# EAGLE schematic BeVimExpansionBoard2 (EAGLE 7.3.0)
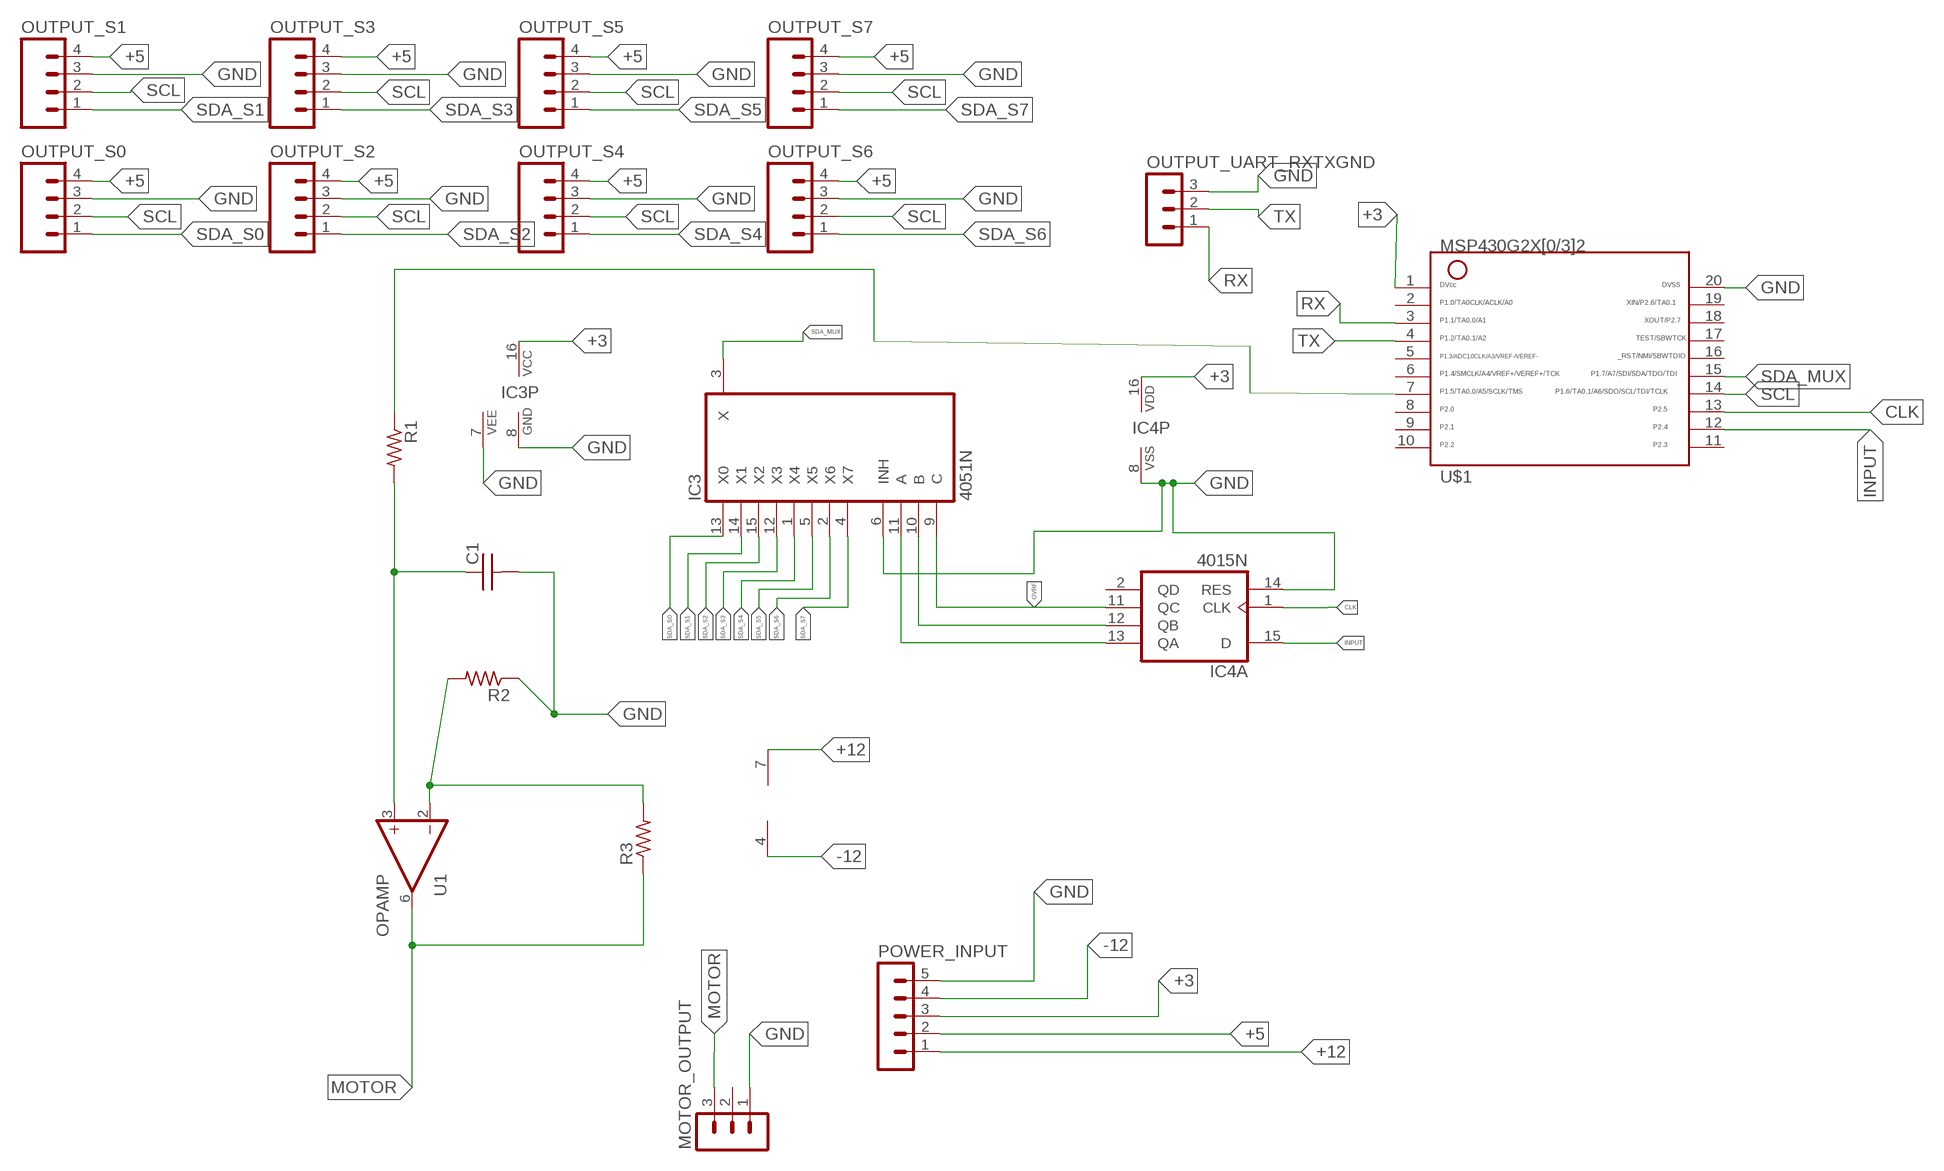
[diagram p0: schematic, sheet 1]

## Parts
C1  CAPACITOR  [BOX-2.5MM-7.2MM]
IC3  4051N  [DIL16]
IC4  4015N  [DIL16]
MOTOR_OUTPUT  MA03-1  [MA03-1]
OUTPUT_S0  M04LOCK  [1X04_LOCK]
OUTPUT_S1  M04LOCK  [1X04_LOCK]
OUTPUT_S2  M04LOCK  [1X04_LOCK]
OUTPUT_S3  M04LOCK  [1X04_LOCK]
OUTPUT_S4  M04LOCK  [1X04_LOCK]
OUTPUT_S5  M04LOCK  [1X04_LOCK]
OUTPUT_S6  M04LOCK  [1X04_LOCK]
OUTPUT_S7  M04LOCK  [1X04_LOCK]
OUTPUT_UART_RXTXGND  MA03-1  [MA03-1]
POWER_INPUT  MA05-1  [MA05-1]
R1  RESISTOR  [0.25W-0.3IN]
R2  RESISTOR  [0.25W-0.3IN]
R3  RESISTOR  [0.25W-0.3IN]
U1  OPAMP  [DIP8]
U$1  G2X[0/3]2---N20  [N20]

## Nets
+3: IC3.16(VCC) IC4.16(P:VDD) POWER_INPUT.3 U$1.1
+5: OUTPUT_S0.4 OUTPUT_S1.4 OUTPUT_S2.4 OUTPUT_S3.4 OUTPUT_S4.4 OUTPUT_S5.4 OUTPUT_S6.4 OUTPUT_S7.4 POWER_INPUT.2
+12: POWER_INPUT.1 U1.7(VCC)
-12: POWER_INPUT.4 U1.4(VEE)
CLK: IC4.1(A:CLK) U$1.13
GND: C1.P$2 IC3.6(INH) IC3.7(VEE) IC3.8(GND) IC4.8(P:VSS) IC4.14(A:RES) MOTOR_OUTPUT.1 OUTPUT_S0.3 OUTPUT_S1.3 OUTPUT_S2.3 OUTPUT_S3.3 OUTPUT_S4.3 OUTPUT_S5.3 OUTPUT_S6.3 OUTPUT_S7.3 OUTPUT_UART_RXTXGND.3 POWER_INPUT.5 R2.1 U$1.20
INPUT: IC4.15(A:D) U$1.12
MOTOR: MOTOR_OUTPUT.3 R3.1 U1.6(OUT)
N$1: IC3.11(A) IC4.13(A:QA)
N$2: IC3.10(B) IC4.12(A:QB)
N$3: C1.P$1 R1.2 U1.3(IN+)
N$4: R2.2 R3.2 U1.2(IN-)
N$5: R1.1 U$1.7
OVRF: IC3.9(C) IC4.11(A:QC)
RX: OUTPUT_UART_RXTXGND.1 U$1.3
SCL: OUTPUT_S0.2 OUTPUT_S1.2 OUTPUT_S2.2 OUTPUT_S3.2 OUTPUT_S4.2 OUTPUT_S5.2 OUTPUT_S6.2 OUTPUT_S7.2 U$1.14
SDA_MUX: IC3.3(X) U$1.15
SDA_S0: IC3.13(X0) OUTPUT_S0.1
SDA_S1: IC3.14(X1) OUTPUT_S1.1
SDA_S2: IC3.15(X2) OUTPUT_S2.1
SDA_S3: IC3.12(X3) OUTPUT_S3.1
SDA_S4: IC3.1(X4) OUTPUT_S4.1
SDA_S5: IC3.5(X5) OUTPUT_S5.1
SDA_S6: IC3.2(X6) OUTPUT_S6.1
SDA_S7: IC3.4(X7) OUTPUT_S7.1
TX: OUTPUT_UART_RXTXGND.2 U$1.4
Unconnected: IC4.2(A:QD) IC4.3(B:QC) IC4.4(B:QB) IC4.5(B:QA) IC4.6(B:RES) IC4.7(B:D) IC4.9(B:CLK) IC4.10(B:QD) MOTOR_OUTPUT.2 U$1.2 U$1.5 U$1.6 U$1.8 U$1.9 U$1.10 U$1.11 U$1.16 U$1.17 U$1.18 U$1.19

## Library data of the parts
C1 = Capacitors:CAPACITOR: Capacitor; SPICE: C{NAME} {1.NET} {2.NET} {VALUE}
IC3 = 40xx:4051: 8-channel ANALOG MULTIPLEXER
IC4 = 40xx:4015: Dual 4-bit static SHIFT REGISTER
MOTOR_OUTPUT OUTPUT_UART_RXTXGND = con-lstb:MA03-1: PIN HEADER; OC_FARNELL: unknown; OC_NEWARK: unknown
OUTPUT_S0 OUTPUT_S1-OUTPUT_S7 = SparkFun-Connectors:M04: Header 4 Standard 4-pin 0.1" header. Use with straight break away headers (SKU : PRT-00116), right angle break away headers (PRT-00553), swiss pins (PRT-00743), machine pins (PRT-00117), and female headers (PRT-00115). Molex polarized connector foot print use with SKU : PRT-08231 with associated crimp pins and housings. 1MM SMD Version SKU: PRT-10208
POWER_INPUT = con-lstb:MA05-1: PIN HEADER; OC_FARNELL: unknown; OC_NEWARK: unknown
R1-R3 = Resistors:RESISTOR: Resistor; SPICE: R{NAME} {1.NET} {2.NET} {VALUE}
U1 = Op Amps:OPAMP: Operational amplifier; SPICE: X{NAME} {IN+.NET} {IN-.NET} {VCC.NET} {VEE.NET} {OUT.NET} OPAMP; SPICEMOD: .SUBCKT OPAMP 1 2 101 102 81\n.model NPN NPN(BF=50000)\nQ1 5 1 7 NPN\nQ2 6 2 8 NPN\nRC1 101 5 95.49\nRC2 101 6 95.49\nRE1 7 4 43.79\nRE2 8 4 43.79\nI1 4 102 0.001\nG1 100 10 6 5 0.0104719\nRP1 10 100 9.549MEG\nCP1 10 100 0.0016667UF\nEOUT 80 100 10 100 1\nRO 80 81 100\nRREF1 101 103 100K\nRREF2 103 102 100K\nEREF 100 0 103 0 1\nR100 100 0 1MEG\n.ENDS
U$1 = TI_MSP430_v16:G2X[0/3]2---N20: MSP430G2X[0/3]2 MSP430G2x32, MSP430G2x02 PDIP (N) 20 Pin Package http://focus.ti.com/docs/prod/folders/print/msp430g2432.html